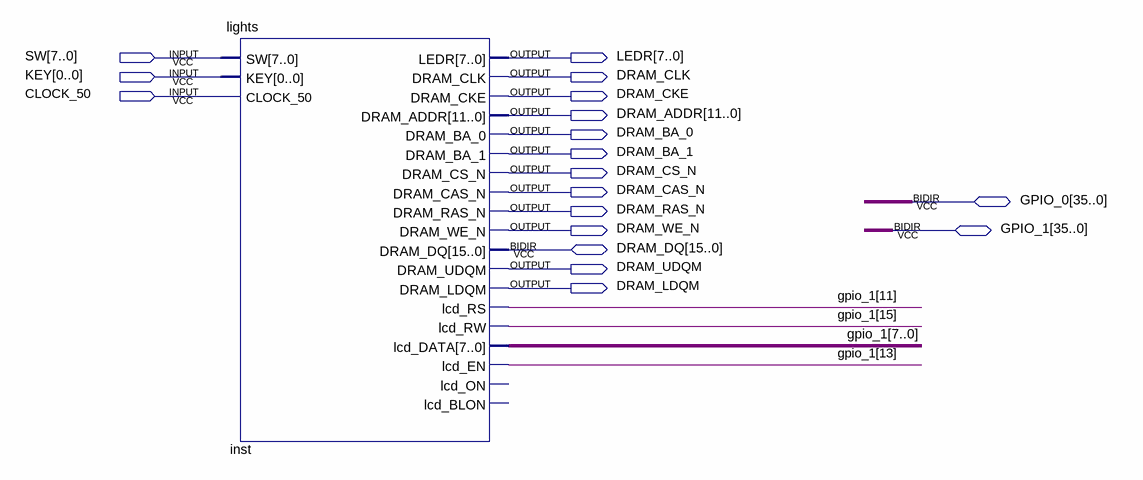
[diagram p0: schematic sheet]
// Quartus schematic myniossystem.bdf as structural Verilog: 1 symbols, 18 pins
module myniossystem (
  input  [7:0] SW,
  input  [0:0] KEY,
  input  CLOCK_50,
  inout  [35:0] GPIO_0,
  inout  [35:0] GPIO_1,
  inout  [15:0] DRAM_DQ,
  output [7:0] LEDR,
  output DRAM_CLK,
  output DRAM_CKE,
  output [11:0] DRAM_ADDR,
  output DRAM_BA_0,
  output DRAM_BA_1,
  output DRAM_CS_N,
  output DRAM_CAS_N,
  output DRAM_RAS_N,
  output DRAM_WE_N,
  output DRAM_UDQM,
  output DRAM_LDQM
);

  lights inst (
    .SW(SW), .KEY(KEY[0]), .CLOCK_50(CLOCK_50), .LEDR(LEDR), .DRAM_CLK(DRAM_CLK), .DRAM_CKE(DRAM_CKE),
    .DRAM_ADDR(DRAM_ADDR), .DRAM_BA_0(DRAM_BA_0), .DRAM_BA_1(DRAM_BA_1), .DRAM_CS_N(DRAM_CS_N),
    .DRAM_CAS_N(DRAM_CAS_N), .DRAM_RAS_N(DRAM_RAS_N), .DRAM_WE_N(DRAM_WE_N), .DRAM_UDQM(DRAM_UDQM),
    .DRAM_LDQM(DRAM_LDQM), .lcd_RS(GPIO_1[11]), .lcd_RW(GPIO_1[15]), .lcd_EN(GPIO_1[13]), .DRAM_DQ(DRAM_DQ),
    .lcd_DATA(GPIO_1[7:0]));  // open: lcd_ON, lcd_BLON
endmodule
